# Altium schematic sheet Bluetooth.SchDoc
size A4
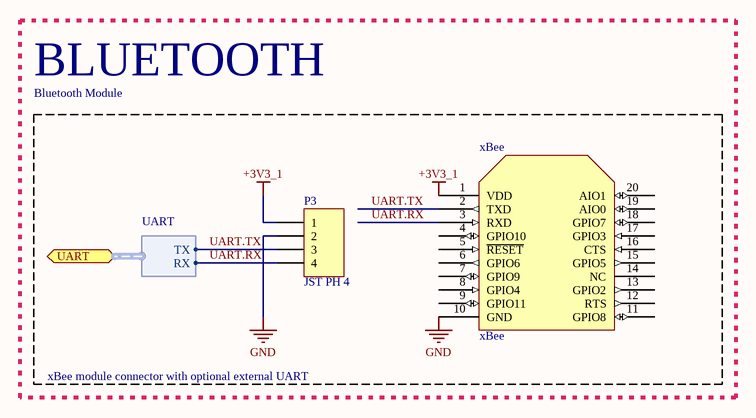
[diagram p0: Bluetooth.SchDoc]

## Parts
P3  JST PH 4  [B4B-PH-K]
xBee  xBee  [xBee]

## Blocks framed on the sheet
BLUETOOTH: P3 xBee

## Ports
UART (harness UART)

## Harnesses
UART: RX, TX

## Nets
+3V3_1: P3.1 xBee.1(VDD)
GND: P3.2 xBee.10(GND)
UART.RX: P3.4 xBee.3(RXD) ; port UART.RX
UART.TX: P3.3 xBee.2(TXD) ; port UART.TX

Not connected (* = marked no-connect by the designer): xBee 4(GPIO10) 5(~{RESET}) 6(GPIO6) 7(GPIO9) 8(GPIO4) 9(GPIO11) 11(GPIO8) 12(RTS) 13(GPIO2) 14(NC) 15(GPIO5) 16(CTS) 17(GPIO3) 18(GPIO7) 19(AIO0) 20(AIO1)

## Notes on the sheet
- Bluetooth Module
- xBee module connector with optional external UART